# Altium schematic sheet SDRAM_DDR3_4x16.SchDoc: Sayma AMC
size 420 x 297 mm; $$Internal___BlkDate: 0:12:25_2-9-18; $$Internal_NAME_PLACEHOLDER: a3sheet; $$Internal_Resolution: 00001mm; $$NotCommonProperty_@NAME: SDRAM_DDR3_4x16; $$NotCommonProperty_@PRINTORDER: 2; $$NotCommonProperty_@SHEET: 1; $$NotCommonProperty_@SHEETTOTAL: 30; CmpIndex: 122; Drawing Author: G.Kasprowicz; Drawing Number: Sayma AMC; Drawing Project: AMC FMC Carrier Board; Drawing Revision: 2.0; SymIndex: 2141; CheckedBy: P.Kulik,T.Przywozki,W.Ruclo; Author: G.Kasprowicz; CompanyName: WUT ISE; DrawnBy: G.Kasprowicz; Organization: WUT ISE; Address1: PW ISE; Address2: Nowowiejska 15/19 00-665 Warsaw; Address3: gkasprow@gmail.com; DocumentNumber: 24; Revision: 2; SheetNumber: 24; SheetTotal: 32; ModifiedBy: -; CheckedDate: -; Title2: DDR3 - 64bit; DivGrp: WUT ISE; Designer: G.Kasprowicz; ModifiedDate: -; ProjectName: Sensor Box
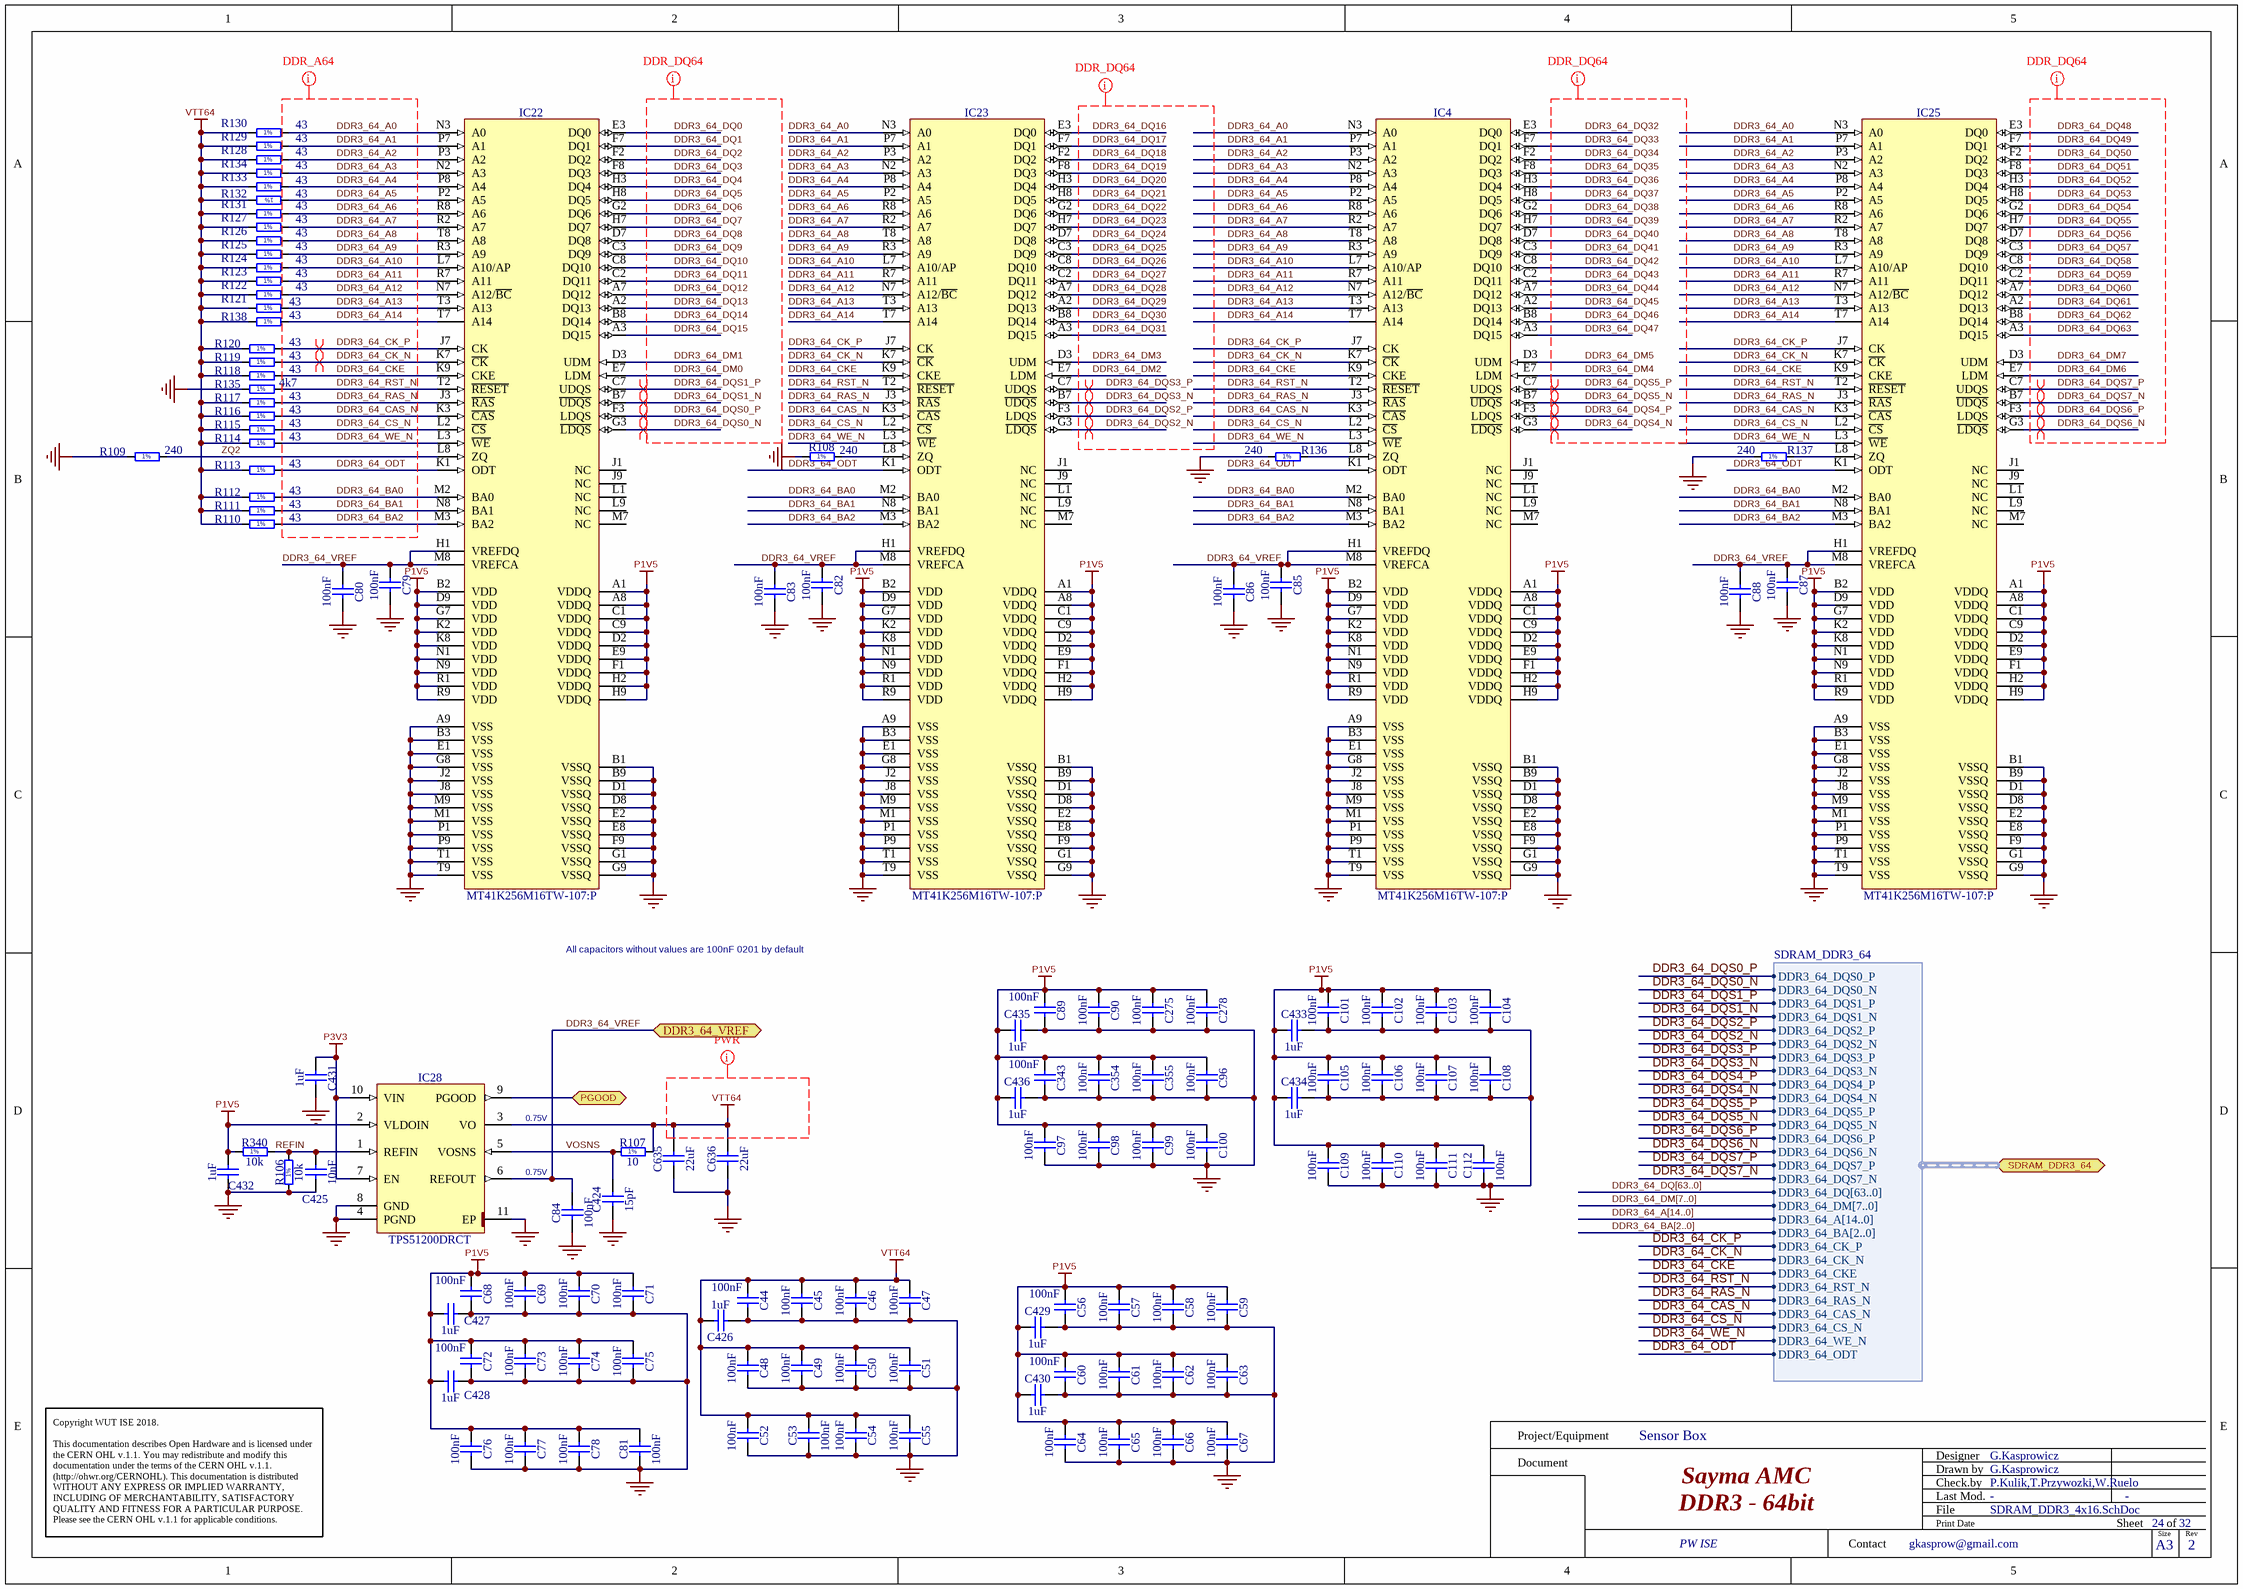
[diagram p0: SDRAM_DDR3_4x16.SchDoc]

## Parts
C44  100nF  [CAPC0603X33N]
C45  100nF  [CAPC0603X33N]
C46  100nF  [CAPC0603X33N]
C47  100nF  [CAPC0603X33N]
C48  100nF  [CAPC0603X33N]
C49  100nF  [CAPC0603X33N]
C50  100nF  [CAPC0603X33N]
C51  100nF  [CAPC0603X33N]
C52  100nF  [CAPC0603X33N]
C53  100nF  [CAPC0603X33N]
C54  100nF  [CAPC0603X33N]
C55  100nF  [CAPC0603X33N]
C56  100nF  [CAPC0603X33N]
C57  100nF  [CAPC0603X33N]
C58  100nF  [CAPC0603X33N]
C59  100nF  [CAPC0603X33N]
C60  100nF  [CAPC0603X33N]
C61  100nF  [CAPC0603X33N]
C62  100nF  [CAPC0603X33N]
C63  100nF  [CAPC0603X33N]
C64  100nF  [CAPC0603X33N]
C65  100nF  [CAPC0603X33N]
C66  100nF  [CAPC0603X33N]
C67  100nF  [CAPC0603X33N]
C68  100nF  [CAPC0603X33N]
C69  100nF  [CAPC0603X33N]
C70  100nF  [CAPC0603X33N]
C71  100nF  [CAPC0603X33N]
C72  100nF  [CAPC0603X33N]
C73  100nF  [CAPC0603X33N]
C74  100nF  [CAPC0603X33N]
C75  100nF  [CAPC0603X33N]
C76  100nF  [CAPC0603X33N]
C77  100nF  [CAPC0603X33N]
C78  100nF  [CAPC0603X33N]
C79  100nF  [CAPC0603X33N]
C80  100nF  [CAPC0603X33N]
C81  100nF  [CAPC0603X33N]
C82  100nF  [CAPC0603X33N]
C83  100nF  [CAPC0603X33N]
C84  100nF  [CAPC0603X33N]
C85  100nF  [CAPC0603X33N]
C86  100nF  [CAPC0603X33N]
C87  100nF  [CAPC0603X33N]
C88  100nF  [CAPC0603X33N]
C89  100nF  [CAPC0603X33N]
C90  100nF  [CAPC0603X33N]
C96  100nF  [CAPC0603X33N]
C97  100nF  [CAPC0603X33N]
C98  100nF  [CAPC0603X33N]
C99  100nF  [CAPC0603X33N]
C100  100nF  [CAPC0603X33N]
C101  100nF  [CAPC0603X33N]
C102  100nF  [CAPC0603X33N]
C103  100nF  [CAPC0603X33N]
C104  100nF  [CAPC0603X33N]
C105  100nF  [CAPC0603X33N]
C106  100nF  [CAPC0603X33N]
C107  100nF  [CAPC0603X33N]
C108  100nF  [CAPC0603X33N]
C109  100nF  [CAPC0603X33N]
C110  100nF  [CAPC0603X33N]
C111  100nF  [CAPC0603X33N]
C112  100nF  [CAPC0603X33N]
C275  100nF  [CAPC0603X33N]
C278  100nF  [CAPC0603X33N]
C343  100nF  [CAPC0603X33N]
C354  100nF  [CAPC0603X33N]
C355  100nF  [CAPC0603X33N]
C424  15pF  [CAPC1005X55N]
C425  10nF  [CAPC1005X55N]
C426  1uF  [CAPC1005X55N]
C427  1uF  [CAPC1005X55N]
C428  1uF  [CAPC1005X55N]
C429  1uF  [CAPC1005X55N]
C430  1uF  [CAPC1005X55N]
C431  1uF  [CAPC1005X55N]
C432  1uF  [CAPC1005X55N]
C433  1uF  [CAPC1005X55N]
C434  1uF  [CAPC1005X55N]
C435  1uF  [CAPC1005X55N]
C436  1uF  [CAPC1005X55N]
C635  22uF  [CAPC2012X135N]
C636  22uF  [CAPC2012X135N]
IC4  MT41K256M16TW-107:P  [BGA96C80P9X16_800X1400X120]
IC22  MT41K256M16TW-107:P  [BGA96C80P9X16_800X1400X120]
IC23  MT41K256M16TW-107:P  [BGA96C80P9X16_800X1400X120]
IC25  MT41K256M16TW-107:P  [BGA96C80P9X16_800X1400X120]
IC28  TPS51200DRCT  [TEXAS_DRC (S-PVSON-N10)]
R106  10k  [RESC1005X40N]
R107  10  [RESC1005X40N]
R108  240  [RESC1005X40N]
R109  240  [RESC1005X40N]
R110  43  [RESC1005X40N]
R111  43  [RESC1005X40N]
R112  43  [RESC1005X40N]
R113  43  [RESC1005X40N]
R114  43  [RESC1005X40N]
R115  43  [RESC1005X40N]
R116  43  [RESC1005X40N]
R117  43  [RESC1005X40N]
R118  43  [RESC1005X40N]
R119  43  [RESC1005X40N]
R120  43  [RESC1005X40N]
R121  43  [RESC1005X40N]
R122  43  [RESC1005X40N]
R123  43  [RESC1005X40N]
R124  43  [RESC1005X40N]
R125  43  [RESC1005X40N]
R126  43  [RESC1005X40N]
R127  43  [RESC1005X40N]
R128  43  [RESC1005X40N]
R129  43  [RESC1005X40N]
R130  43  [RESC1005X40N]
R131  43  [RESC1005X40N]
R132  43  [RESC1005X40N]
R133  43  [RESC1005X40N]
R134  43  [RESC1005X40N]
R135  4k7  [RESC1005X40N]
R136  240  [RESC1005X40N]
R137  240  [RESC1005X40N]
R138  43  [RESC1005X40N]
R340  10k  [RESC1005X40N]

## Ports
DDR3_64_VREF (bidir), PGOOD (bidir), SDRAM_DDR3_64 (bidir, harness SDRAM_DDR3_64)

## Harnesses
SDRAM_DDR3_64: DDR3_64_DQS0_P, DDR3_64_DQS0_N, DDR3_64_DQS1_P, DDR3_64_DQS1_N, DDR3_64_DQS2_P, DDR3_64_DQS2_N, DDR3_64_DQS3_P, DDR3_64_DQS3_N, DDR3_64_DQS4_P, DDR3_64_DQS4_N, DDR3_64_DQS5_P, DDR3_64_DQS5_N, DDR3_64_DQS6_P, DDR3_64_DQS6_N, DDR3_64_DQS7_P, DDR3_64_DQS7_N, DDR3_64_DQ[63..0], DDR3_64_DM[7..0], DDR3_64_A[14..0], DDR3_64_BA[2..0], DDR3_64_CK_P, DDR3_64_CK_N, DDR3_64_CKE, DDR3_64_RST_N, DDR3_64_RAS_N, DDR3_64_CAS_N, DDR3_64_CS_N, DDR3_64_WE_N, DDR3_64_ODT

## Nets
GND: C44.2 C45.2 C46.2 C47.2 C48.2 C49.2 C50.2 C51.2 C52.2 C53.2 C54.2 C55.2 C56.2 C57.2 C58.2 C59.2 C60.2 C61.2 C62.2 C63.2 C64.2 C65.2 C66.2 C67.2 C68.2 C69.2 C70.2 C71.2 C72.2 C73.2 C74.2 C75.2 C76.2 C77.2 C78.2 C79.2 C80.2 C81.1 C82.2 C83.2 C84.1 C85.2 C86.2 C87.2 C88.2 C89.2 C90.2 C96.2 C97.2 C98.2 C99.2 C100.2 C101.2 C102.2 C103.2 C104.2 C105.2 C106.2 C107.2 C108.2 C109.2 C110.2 C111.2 C112.1 C275.2 C278.2 C343.2 C354.2 C355.2 C424.1 C425.1 C426.2 C427.2 C428.2 C429.2 C430.2 C431.2 C432.2 C433.2 C434.2 C435.2 C436.2 C635.1 C636.1 IC4.A9(VSS) IC4.B1(VSSQ) IC4.B3(VSS) IC4.B9(VSSQ) IC4.D1(VSSQ) IC4.D8(VSSQ) IC4.E1(VSS) IC4.E2(VSSQ) IC4.E8(VSSQ) IC4.F9(VSSQ) IC4.G1(VSSQ) IC4.G8(VSS) IC4.G9(VSSQ) IC4.J2(VSS) IC4.J8(VSS) IC4.M1(VSS) IC4.M9(VSS) IC4.P1(VSS) IC4.P9(VSS) IC4.T1(VSS) IC4.T9(VSS) IC22.A9(VSS) IC22.B1(VSSQ) IC22.B3(VSS) IC22.B9(VSSQ) IC22.D1(VSSQ) IC22.D8(VSSQ) IC22.E1(VSS) IC22.E2(VSSQ) IC22.E8(VSSQ) IC22.F9(VSSQ) IC22.G1(VSSQ) IC22.G8(VSS) IC22.G9(VSSQ) IC22.J2(VSS) IC22.J8(VSS) IC22.M1(VSS) IC22.M9(VSS) IC22.P1(VSS) IC22.P9(VSS) IC22.T1(VSS) IC22.T9(VSS) IC23.A9(VSS) IC23.B1(VSSQ) IC23.B3(VSS) IC23.B9(VSSQ) IC23.D1(VSSQ) IC23.D8(VSSQ) IC23.E1(VSS) IC23.E2(VSSQ) IC23.E8(VSSQ) IC23.F9(VSSQ) IC23.G1(VSSQ) IC23.G8(VSS) IC23.G9(VSSQ) IC23.J2(VSS) IC23.J8(VSS) IC23.M1(VSS) IC23.M9(VSS) IC23.P1(VSS) IC23.P9(VSS) IC23.T1(VSS) IC23.T9(VSS) IC25.A9(VSS) IC25.B1(VSSQ) IC25.B3(VSS) IC25.B9(VSSQ) IC25.D1(VSSQ) IC25.D8(VSSQ) IC25.E1(VSS) IC25.E2(VSSQ) IC25.E8(VSSQ) IC25.F9(VSSQ) IC25.G1(VSSQ) IC25.G8(VSS) IC25.G9(VSSQ) IC25.J2(VSS) IC25.J8(VSS) IC25.M1(VSS) IC25.M9(VSS) IC25.P1(VSS) IC25.P9(VSS) IC25.T1(VSS) IC25.T9(VSS) IC28.4(PGND) IC28.8(GND) IC28.11(EP) R106.1 R108.1 R109.1 R135.1 R136.1 R137.1
P1V5: C56.1 C57.1 C58.1 C59.1 C60.1 C61.1 C62.1 C63.1 C64.1 C65.1 C66.1 C67.1 C68.1 C69.1 C70.1 C71.1 C72.1 C73.1 C74.1 C75.1 C76.1 C77.1 C78.1 C81.2 C89.1 C90.1 C96.1 C97.1 C98.1 C99.1 C100.1 C101.1 C102.1 C103.1 C104.1 C105.1 C106.1 C107.1 C108.1 C109.1 C110.1 C111.1 C112.2 C275.1 C278.1 C343.1 C354.1 C355.1 C427.1 C428.1 C429.1 C430.1 C432.1 C433.1 C434.1 C435.1 C436.1 IC4.A1(VDDQ) IC4.A8(VDDQ) IC4.B2(VDD) IC4.C1(VDDQ) IC4.C9(VDDQ) IC4.D2(VDDQ) IC4.D9(VDD) IC4.E9(VDDQ) IC4.F1(VDDQ) IC4.G7(VDD) IC4.H2(VDDQ) IC4.H9(VDDQ) IC4.K2(VDD) IC4.K8(VDD) IC4.N1(VDD) IC4.N9(VDD) IC4.R1(VDD) IC4.R9(VDD) IC22.A1(VDDQ) IC22.A8(VDDQ) IC22.B2(VDD) IC22.C1(VDDQ) IC22.C9(VDDQ) IC22.D2(VDDQ) IC22.D9(VDD) IC22.E9(VDDQ) IC22.F1(VDDQ) IC22.G7(VDD) IC22.H2(VDDQ) IC22.H9(VDDQ) IC22.K2(VDD) IC22.K8(VDD) IC22.N1(VDD) IC22.N9(VDD) IC22.R1(VDD) IC22.R9(VDD) IC23.A1(VDDQ) IC23.A8(VDDQ) IC23.B2(VDD) IC23.C1(VDDQ) IC23.C9(VDDQ) IC23.D2(VDDQ) IC23.D9(VDD) IC23.E9(VDDQ) IC23.F1(VDDQ) IC23.G7(VDD) IC23.H2(VDDQ) IC23.H9(VDDQ) IC23.K2(VDD) IC23.K8(VDD) IC23.N1(VDD) IC23.N9(VDD) IC23.R1(VDD) IC23.R9(VDD) IC25.A1(VDDQ) IC25.A8(VDDQ) IC25.B2(VDD) IC25.C1(VDDQ) IC25.C9(VDDQ) IC25.D2(VDDQ) IC25.D9(VDD) IC25.E9(VDDQ) IC25.F1(VDDQ) IC25.G7(VDD) IC25.H2(VDDQ) IC25.H9(VDDQ) IC25.K2(VDD) IC25.K8(VDD) IC25.N1(VDD) IC25.N9(VDD) IC25.R1(VDD) IC25.R9(VDD) IC28.2(VLDOIN) R340.1
P3V3: C431.1 IC28.7(EN) IC28.10(VIN)
VTT64: C44.1 C45.1 C46.1 C47.1 C48.1 C49.1 C50.1 C51.1 C52.1 C53.1 C54.1 C55.1 C426.1 C635.2 C636.2 IC28.3(VO) R107.2 R110.1 R111.1 R112.1 R113.1 R114.1 R115.1 R116.1 R117.1 R118.1 R119.1 R120.1 R121.1 R122.1 R123.1 R124.1 R125.1 R126.1 R127.1 R128.1 R129.1 R130.1 R131.1 R132.1 R133.1 R134.1 R138.1
DDR3_64_A0: IC4.N3(A0) IC22.N3(A0) IC23.N3(A0) IC25.N3(A0) R130.2
DDR3_64_A1: IC4.P7(A1) IC22.P7(A1) IC23.P7(A1) IC25.P7(A1) R129.2
DDR3_64_A2: IC4.P3(A2) IC22.P3(A2) IC23.P3(A2) IC25.P3(A2) R128.2
DDR3_64_A3: IC4.N2(A3) IC22.N2(A3) IC23.N2(A3) IC25.N2(A3) R134.2
DDR3_64_A4: IC4.P8(A4) IC22.P8(A4) IC23.P8(A4) IC25.P8(A4) R133.2
DDR3_64_A5: IC4.P2(A5) IC22.P2(A5) IC23.P2(A5) IC25.P2(A5) R132.2
DDR3_64_A6: IC4.R8(A6) IC22.R8(A6) IC23.R8(A6) IC25.R8(A6) R131.2
DDR3_64_A7: IC4.R2(A7) IC22.R2(A7) IC23.R2(A7) IC25.R2(A7) R127.2
DDR3_64_A8: IC4.T8(A8) IC22.T8(A8) IC23.T8(A8) IC25.T8(A8) R126.2
DDR3_64_A9: IC4.R3(A9) IC22.R3(A9) IC23.R3(A9) IC25.R3(A9) R125.2
DDR3_64_A10: IC4.L7(A10/AP) IC22.L7(A10/AP) IC23.L7(A10/AP) IC25.L7(A10/AP) R124.2
DDR3_64_A11: IC4.R7(A11) IC22.R7(A11) IC23.R7(A11) IC25.R7(A11) R123.2
DDR3_64_A12: IC4.N7(A12/~{BC}) IC22.N7(A12/~{BC}) IC23.N7(A12/~{BC}) IC25.N7(A12/~{BC}) R122.2
DDR3_64_A13: IC4.T3(A13) IC22.T3(A13) IC23.T3(A13) IC25.T3(A13) R121.2
DDR3_64_A14: IC4.T7(A14) IC22.T7(A14) IC23.T7(A14) IC25.T7(A14) R138.2
DDR3_64_BA0: IC4.M2(BA0) IC22.M2(BA0) IC23.M2(BA0) IC25.M2(BA0) R112.2
DDR3_64_BA1: IC4.N8(BA1) IC22.N8(BA1) IC23.N8(BA1) IC25.N8(BA1) R111.2
DDR3_64_BA2: IC4.M3(BA2) IC22.M3(BA2) IC23.M3(BA2) IC25.M3(BA2) R110.2
DDR3_64_CAS_N: IC4.K3(~{CAS}) IC22.K3(~{CAS}) IC23.K3(~{CAS}) IC25.K3(~{CAS}) R116.2 ; port SDRAM_DDR3_64.DDR3_64_CAS_N
DDR3_64_CK_N: IC4.K7(~{CK}) IC22.K7(~{CK}) IC23.K7(~{CK}) IC25.K7(~{CK}) R119.2 ; port SDRAM_DDR3_64.DDR3_64_CK_N
DDR3_64_CK_P: IC4.J7(CK) IC22.J7(CK) IC23.J7(CK) IC25.J7(CK) R120.2 ; port SDRAM_DDR3_64.DDR3_64_CK_P
DDR3_64_CKE: IC4.K9(CKE) IC22.K9(CKE) IC23.K9(CKE) IC25.K9(CKE) R118.2 ; port SDRAM_DDR3_64.DDR3_64_CKE
DDR3_64_CS_N: IC4.L2(~{CS}) IC22.L2(~{CS}) IC23.L2(~{CS}) IC25.L2(~{CS}) R115.2 ; port SDRAM_DDR3_64.DDR3_64_CS_N
DDR3_64_DM0: IC22.E7(LDM)
DDR3_64_DM1: IC22.D3(UDM)
DDR3_64_DM2: IC23.E7(LDM)
DDR3_64_DM3: IC23.D3(UDM)
DDR3_64_DM4: IC4.E7(LDM)
DDR3_64_DM5: IC4.D3(UDM)
DDR3_64_DM6: IC25.E7(LDM)
DDR3_64_DM7: IC25.D3(UDM)
DDR3_64_DQ0: IC22.E3(DQ0)
DDR3_64_DQ1: IC22.F7(DQ1)
DDR3_64_DQ2: IC22.F2(DQ2)
DDR3_64_DQ3: IC22.F8(DQ3)
DDR3_64_DQ4: IC22.H3(DQ4)
DDR3_64_DQ5: IC22.H8(DQ5)
DDR3_64_DQ6: IC22.G2(DQ6)
DDR3_64_DQ7: IC22.H7(DQ7)
DDR3_64_DQ8: IC22.D7(DQ8)
DDR3_64_DQ9: IC22.C3(DQ9)
DDR3_64_DQ10: IC22.C8(DQ10)
DDR3_64_DQ11: IC22.C2(DQ11)
DDR3_64_DQ12: IC22.A7(DQ12)
DDR3_64_DQ13: IC22.A2(DQ13)
DDR3_64_DQ14: IC22.B8(DQ14)
DDR3_64_DQ15: IC22.A3(DQ15)
DDR3_64_DQ16: IC23.E3(DQ0)
DDR3_64_DQ17: IC23.F7(DQ1)
DDR3_64_DQ18: IC23.F2(DQ2)
DDR3_64_DQ19: IC23.F8(DQ3)
DDR3_64_DQ20: IC23.H3(DQ4)
DDR3_64_DQ21: IC23.H8(DQ5)
DDR3_64_DQ22: IC23.G2(DQ6)
DDR3_64_DQ23: IC23.H7(DQ7)
DDR3_64_DQ24: IC23.D7(DQ8)
DDR3_64_DQ25: IC23.C3(DQ9)
DDR3_64_DQ26: IC23.C8(DQ10)
DDR3_64_DQ27: IC23.C2(DQ11)
DDR3_64_DQ28: IC23.A7(DQ12)
DDR3_64_DQ29: IC23.A2(DQ13)
DDR3_64_DQ30: IC23.B8(DQ14)
DDR3_64_DQ31: IC23.A3(DQ15)
DDR3_64_DQ32: IC4.E3(DQ0)
DDR3_64_DQ33: IC4.F7(DQ1)
DDR3_64_DQ34: IC4.F2(DQ2)
DDR3_64_DQ35: IC4.F8(DQ3)
DDR3_64_DQ36: IC4.H3(DQ4)
DDR3_64_DQ37: IC4.H8(DQ5)
DDR3_64_DQ38: IC4.G2(DQ6)
DDR3_64_DQ39: IC4.H7(DQ7)
DDR3_64_DQ40: IC4.D7(DQ8)
DDR3_64_DQ41: IC4.C3(DQ9)
DDR3_64_DQ42: IC4.C8(DQ10)
DDR3_64_DQ43: IC4.C2(DQ11)
DDR3_64_DQ44: IC4.A7(DQ12)
DDR3_64_DQ45: IC4.A2(DQ13)
DDR3_64_DQ46: IC4.B8(DQ14)
DDR3_64_DQ47: IC4.A3(DQ15)
DDR3_64_DQ48: IC25.E3(DQ0)
DDR3_64_DQ49: IC25.F7(DQ1)
DDR3_64_DQ50: IC25.F2(DQ2)
DDR3_64_DQ51: IC25.F8(DQ3)
DDR3_64_DQ52: IC25.H3(DQ4)
DDR3_64_DQ53: IC25.H8(DQ5)
DDR3_64_DQ54: IC25.G2(DQ6)
DDR3_64_DQ55: IC25.H7(DQ7)
DDR3_64_DQ56: IC25.D7(DQ8)
DDR3_64_DQ57: IC25.C3(DQ9)
DDR3_64_DQ58: IC25.C8(DQ10)
DDR3_64_DQ59: IC25.C2(DQ11)
DDR3_64_DQ60: IC25.A7(DQ12)
DDR3_64_DQ61: IC25.A2(DQ13)
DDR3_64_DQ62: IC25.B8(DQ14)
DDR3_64_DQ63: IC25.A3(DQ15)
DDR3_64_DQS0_N: IC22.G3(~{LDQS}) ; port SDRAM_DDR3_64.DDR3_64_DQS0_N
DDR3_64_DQS0_P: IC22.F3(LDQS) ; port SDRAM_DDR3_64.DDR3_64_DQS0_P
DDR3_64_DQS1_N: IC22.B7(~{UDQS}) ; port SDRAM_DDR3_64.DDR3_64_DQS1_N
DDR3_64_DQS1_P: IC22.C7(UDQS) ; port SDRAM_DDR3_64.DDR3_64_DQS1_P
DDR3_64_DQS2_N: IC23.G3(~{LDQS}) ; port SDRAM_DDR3_64.DDR3_64_DQS2_N
DDR3_64_DQS2_P: IC23.F3(LDQS) ; port SDRAM_DDR3_64.DDR3_64_DQS2_P
DDR3_64_DQS3_N: IC23.B7(~{UDQS}) ; port SDRAM_DDR3_64.DDR3_64_DQS3_N
DDR3_64_DQS3_P: IC23.C7(UDQS) ; port SDRAM_DDR3_64.DDR3_64_DQS3_P
DDR3_64_DQS4_N: IC4.G3(~{LDQS}) ; port SDRAM_DDR3_64.DDR3_64_DQS4_N
DDR3_64_DQS4_P: IC4.F3(LDQS) ; port SDRAM_DDR3_64.DDR3_64_DQS4_P
DDR3_64_DQS5_N: IC4.B7(~{UDQS}) ; port SDRAM_DDR3_64.DDR3_64_DQS5_N
DDR3_64_DQS5_P: IC4.C7(UDQS) ; port SDRAM_DDR3_64.DDR3_64_DQS5_P
DDR3_64_DQS6_N: IC25.G3(~{LDQS}) ; port SDRAM_DDR3_64.DDR3_64_DQS6_N
DDR3_64_DQS6_P: IC25.F3(LDQS) ; port SDRAM_DDR3_64.DDR3_64_DQS6_P
DDR3_64_DQS7_N: IC25.B7(~{UDQS}) ; port SDRAM_DDR3_64.DDR3_64_DQS7_N
DDR3_64_DQS7_P: IC25.C7(UDQS) ; port SDRAM_DDR3_64.DDR3_64_DQS7_P
DDR3_64_ODT: IC4.K1(ODT) IC22.K1(ODT) IC23.K1(ODT) IC25.K1(ODT) R113.2 ; port SDRAM_DDR3_64.DDR3_64_ODT
DDR3_64_RAS_N: IC4.J3(~{RAS}) IC22.J3(~{RAS}) IC23.J3(~{RAS}) IC25.J3(~{RAS}) R117.2 ; port SDRAM_DDR3_64.DDR3_64_RAS_N
DDR3_64_RST_N: IC4.T2(~{RESET}) IC22.T2(~{RESET}) IC23.T2(~{RESET}) IC25.T2(~{RESET}) R135.2 ; port SDRAM_DDR3_64.DDR3_64_RST_N
DDR3_64_VREF: C79.1 C80.1 C82.1 C83.1 C84.2 C85.1 C86.1 C87.1 C88.1 IC4.H1(VREFDQ) IC4.M8(VREFCA) IC22.H1(VREFDQ) IC22.M8(VREFCA) IC23.H1(VREFDQ) IC23.M8(VREFCA) IC25.H1(VREFDQ) IC25.M8(VREFCA) IC28.6(REFOUT) ; port DDR3_64_VREF
DDR3_64_WE_N: IC4.L3(~{WE}) IC22.L3(~{WE}) IC23.L3(~{WE}) IC25.L3(~{WE}) R114.2 ; port SDRAM_DDR3_64.DDR3_64_WE_N
PGOOD: IC28.9(PGOOD) ; port PGOOD
REFIN: C425.2 IC28.1(REFIN) R106.2 R340.2
VOSNS: C424.2 IC28.5(VOSNS) R107.1
ZQ2: IC22.L8(ZQ) R109.2
NetIC4_L8: IC4.L8(ZQ) R136.2
NetIC23_L8: IC23.L8(ZQ) R108.2
NetIC25_L8: IC25.L8(ZQ) R137.2

Not connected (* = marked no-connect by the designer): IC4 J1(NC) J9(NC) L1(NC) L9(NC) M7(NC); IC22 J1(NC) J9(NC) L1(NC) L9(NC) M7(NC); IC23 J1(NC) J9(NC) L1(NC) L9(NC) M7(NC); IC25 J1(NC) J9(NC) L1(NC) L9(NC) M7(NC)

## Buses and harness runs
bus DDR3_64_A[14..0]
bus DDR3_64_BA[2..0]
bus DDR3_64_DM[7..0]
bus DDR3_64_DQ[63..0]

## Layout directives
differential pair: DDR3_64_CK_N, DDR3_64_CK_P, DDR3_64_DQS0_N, DDR3_64_DQS0_P, DDR3_64_DQS1_N, DDR3_64_DQS1_P, DDR3_64_DQS2_N, DDR3_64_DQS2_P, DDR3_64_DQS3_N, DDR3_64_DQS3_P, DDR3_64_DQS4_N, DDR3_64_DQS4_P, DDR3_64_DQS5_N, DDR3_64_DQS5_P, DDR3_64_DQS6_N, DDR3_64_DQS6_P, DDR3_64_DQS7_N, DDR3_64_DQS7_P
net class DDR_DQ64: DDR3_64_DM0, DDR3_64_DM1, DDR3_64_DM2, DDR3_64_DM3, DDR3_64_DM4, DDR3_64_DM5, DDR3_64_DM6, DDR3_64_DM7, DDR3_64_DQ0, DDR3_64_DQ1, DDR3_64_DQ2, DDR3_64_DQ3, DDR3_64_DQ4, DDR3_64_DQ5, DDR3_64_DQ6, DDR3_64_DQ7, DDR3_64_DQ8, DDR3_64_DQ9, DDR3_64_DQ10, DDR3_64_DQ11, DDR3_64_DQ12, DDR3_64_DQ13, DDR3_64_DQ14, DDR3_64_DQ15, DDR3_64_DQ16, DDR3_64_DQ17, DDR3_64_DQ18, DDR3_64_DQ19, DDR3_64_DQ20, DDR3_64_DQ21, DDR3_64_DQ22, DDR3_64_DQ23, DDR3_64_DQ24, DDR3_64_DQ25, DDR3_64_DQ26, DDR3_64_DQ27, DDR3_64_DQ28, DDR3_64_DQ29, DDR3_64_DQ30, DDR3_64_DQ31, DDR3_64_DQ32, DDR3_64_DQ33, DDR3_64_DQ34, DDR3_64_DQ35, DDR3_64_DQ36, DDR3_64_DQ37, DDR3_64_DQ38, DDR3_64_DQ39, DDR3_64_DQ40, DDR3_64_DQ41, DDR3_64_DQ42, DDR3_64_DQ43, DDR3_64_DQ44, DDR3_64_DQ45, DDR3_64_DQ46, DDR3_64_DQ47, DDR3_64_DQ48, DDR3_64_DQ49, DDR3_64_DQ50, DDR3_64_DQ51, DDR3_64_DQ52, DDR3_64_DQ53, DDR3_64_DQ54, DDR3_64_DQ55, DDR3_64_DQ56, DDR3_64_DQ57, DDR3_64_DQ58, DDR3_64_DQ59, DDR3_64_DQ60, DDR3_64_DQ61, DDR3_64_DQ62, DDR3_64_DQ63, DDR3_64_DQS0_N, DDR3_64_DQS0_P, DDR3_64_DQS1_N, DDR3_64_DQS1_P, DDR3_64_DQS2_N, DDR3_64_DQS2_P, DDR3_64_DQS3_N, DDR3_64_DQS3_P, DDR3_64_DQS4_N, DDR3_64_DQS4_P, DDR3_64_DQS5_N, DDR3_64_DQS5_P, DDR3_64_DQS6_N, DDR3_64_DQS6_P, DDR3_64_DQS7_N, DDR3_64_DQS7_P
net class DDR_A64: DDR3_64_A0, DDR3_64_A1, DDR3_64_A2, DDR3_64_A3, DDR3_64_A4, DDR3_64_A5, DDR3_64_A6, DDR3_64_A7, DDR3_64_A8, DDR3_64_A9, DDR3_64_A10, DDR3_64_A11, DDR3_64_A12, DDR3_64_A13, DDR3_64_A14, DDR3_64_BA0, DDR3_64_BA1, DDR3_64_BA2, DDR3_64_CAS_N, DDR3_64_CK_N, DDR3_64_CK_P, DDR3_64_CKE, DDR3_64_CS_N, DDR3_64_ODT, DDR3_64_RAS_N, DDR3_64_RST_N, DDR3_64_WE_N
net class PWR: VTT64

## Notes on the sheet
- All capacitors without values are 100nF 0201 by default
- (near IC28) 0.75V
- 0.75V
- Project/Equipment
- Document
- Designer
- Drawn by
- Check.by
- Copyright WUT ISE 2018.
  This documentation describes Open Hardware and is licensed under the CERN OHL v.1.1. You may redistribute and modify this documentation under the terms of the CERN OHL v.1.1. (http://ohwr.org/CERNOHL). This documentation is distributed WITHOUT ANY EXPRESS OR IMPLIED WARRANTY, INCLUDING OF MERCHANTABILITY, SATISFACTORY QUALITY AND FITNESS FOR A PARTICULAR PURPOSE. Please see the CERN OHL v.1.1 for applicable conditions.
- Contact
- File
- Last Mod.
- Print Date
- Sheet
- Size
- A3
- of
- Rev
- (in symbol R0402_4K7_1%_0.0625W_100PPM) 1%
- (in symbol R0402_10K_1%_0.0625W_100PPM) 1%
- (in symbol R0402_10R_1%_0.0625W_200PPM) 1%
- (in symbol R0402_43R_1%_0.0625W_100PPM) 1%
- (in symbol R0402_240R_1%_0.0625W_100PPM) 1%

## Library data of the parts
C44-C90 C96-C112 C275 C278 C343 C354 C355 = CC0201_100NF_6.3V_10%_X5R: Non-polarised capacitor; Manufacturer: GENERIC; Part Description: SMD Multilayer Chip Ceramic Capacitor; Manufacturer1 Part Number: 02016D104KAT2A; Tolerance: ±10%; Voltage: 6.3V; TC: X5R; Manufacturer Part Number: CC0201_100NF_6.3V_10%_X5R; Part Number: CC0201_100NF_6.3V_10%_X5R; Value: 100nF; Component Kind: Standard; Component Type: Standard; Pin Count: 2; Status: Not Recommended; Case: 0201; Mounted: Yes; Socket: No; SMD: Yes; Sense: No; Manufacturer1 Example: AVX; Manufacturer1 ComponentHeight: 0.33mm; HelpURL: \\cern.ch\dfs\Applications\Altium\Datasheets\CC0201_X5R_AVX.pdf; Author: CERN DEM JLC; CreateDate: 03.12.2007; LatestRevisionDate: 03.12.2007
C424 = CC0402_15PF_50V_5%_C0G: Non-polarised capacitor; Manufacturer: GENERIC; Part Description: SMD Multilayer Chip Ceramic Capacitor; Manufacturer1 Part Number: C0402C150J5GACTU; Tolerance: ±5%; Voltage: 50V; TC: C0G/NP0; Manufacturer Part Number: CC0402_15PF_50V_5%_C0G; Part Number: CC0402_15PF_50V_5%_C0G; Value: 15pF; Component Kind: Standard; Component Type: Standard; Pin Count: 2; Status: Preferred; Case: 0402; Mounted: Yes; Socket: No; SMD: Yes; Sense: No; Manufacturer1 Example: KEMET; Manufacturer1 ComponentHeight: 0.55mm; HelpURL: \\cern.ch\dfs\Applications\Altium\Datasheets\CC0805_C0G_KEMET_(Commercial Grade).pdf; Author: CERN DEM JLC; CreateDate: 03.12.2007; LatestRevisionDate: 22.04.2015
C425 = CC0402_10NF_25V_10%_X7R: Non-polarised capacitor; Manufacturer: GENERIC; Part Description: SMD Multilayer Chip Ceramic Capacitor; Manufacturer1 Part Number: C1005X7R1E103KT; Tolerance: ±10%; Voltage: 25V; TC: X7R; Manufacturer Part Number: CC0402_10NF_25V_10%_X7R; Part Number: CC0402_10NF_25V_10%_X7R; Value: 10nF; Component Kind: Standard; Component Type: Standard; Pin Count: 2; Status: Preferred; Case: 0402; Mounted: Yes; Socket: No; SMD: Yes; Sense: No; Manufacturer1 Example: TDK; Manufacturer1 ComponentHeight: 0.55mm; HelpURL: \\cern.ch\dfs\Applications\Altium\Datasheets\CC0402_X7R_TDK_C.pdf; Author: CERN DEM JLC; CreateDate: 25.10.2012; LatestRevisionDate: 25.10.2012
C426-C436 = CC0402_1UF_16V_10%_X5R: Non-polarised capacitor; Manufacturer: GENERIC; Part Description: SMD Multilayer Chip Ceramic Capacitor; Manufacturer1 Part Number: C1005X5R1C105KT; Tolerance: ±10%; Voltage: 16V; TC: X5R; Manufacturer Part Number: CC0402_1UF_16V_10%_X5R; Part Number: CC0402_1UF_16V_10%_X5R; Value: 1uF; Component Kind: Standard; Component Type: Standard; Pin Count: 2; Status: Preferred; Case: 0402; Mounted: Yes; Socket: No; SMD: Yes; Sense: No; Manufacturer1 Example: TDK; Manufacturer1 ComponentHeight: 0.55mm; HelpURL: \\cern.ch\dfs\Applications\Altium\Datasheets\CC0402_X5R_TDK_C.pdf; Author: CERN DEM JLC; CreateDate: 25.10.2012; LatestRevisionDate: 25.10.2012
C635 C636 = CC0805_22UF_10V_+80%-20%_Y5V: Non-polarised capacitor; Manufacturer: GENERIC; Part Description: SMD Multilayer Chip Ceramic Capacitor; Manufacturer1 Part Number: 2222 241 19881; Voltage: 10V; TC: Y5V; Manufacturer Part Number: CC0805_22UF_10V_+80%-20%_Y5V; Part Number: CC0805_22UF_10V_+80%-20%_Y5V; Tolerance: +80% -20%; Value: 22uF; Component Kind: Standard; Component Type: Standard; Pin Count: 2; Status: Preferred; Case: 0805; Mounted: Yes; Socket: No; SMD: Yes; Sense: No; Manufacturer1 Example: PHYCOMP; Manufacturer1 ComponentHeight: 1.45mm; HelpURL: \\cern.ch\dfs\Applications\Altium\Datasheets\CC0805_Y5V_PHYCOMP.pdf; Author: CERN DEM JLC; CreateDate: 03.12.2007; LatestRevisionDate: 03.12.2007
IC4 IC22 IC23 IC25 = MT41K256M16TW-107:P: 32 Meg x 16 x 8 Banks DDR3L SDRAM; Manufacturer: MICRON TECHNOLOGY; Part Description: +1.5V, 4Gb (32Meg x 16 x 8 banks) DDR3L SDRAM; PressFit: No; Bonding: No; Manufacturer Part Number: MT41K256M16TW-107:P; Part Number: MT41K256M16TW-107:P; Component Kind: Standard; Component Type: Standard; Device: MT41K256M16TW-107:P; PackageDescription: BGA 0.8mm, Pitch, Square 96 Pin, 9 Columns x 16 Rows, Body 14mm X 8mm X 1.2mm H; Pin Count: 96; Case: BGA96; Mounted: Yes; Socket: No; SMD: Yes; Sense: No; ComponentHeight: 1.2mm; HelpURL: \\cern.ch\dfs\Applications\Altium\Datasheets\MT41K256M16TW-107-P.pdf; Author: CERN DEM MR; CreateDate: 14.12.2015; LatestRevisionDate: 14.12.2015
IC28 = TPS51200DRCT: Sink/Source DDR Termination Regulator; Manufacturer: TEXAS INSTRUMENTS; Part Description: 3.3V Sink/Source DDR Termination Regulator; PressFit: No; Bonding: No; Manufacturer Part Number: TPS51200DRCT; PackageDescription: SON, 0.50mm Pitch, 10-pin, 3.00mm W  X 3.00mm L X 1.00mm Height, (w/thermal tab 1.75 X 2.50 mm); Part Number: TPS51200DRCT; Component Kind: Standard; Component Type: Standard; Device: TPS51200DRCT; Pin Count: 11; Case: SON10; Mounted: Yes; Socket: No; SMD: Yes; Sense: No; ComponentHeight: 1mm; HelpURL: \\cern.ch\dfs\Applications\Altium\Datasheets\TPS51200DRCT.pdf; Author: CERN DEM JLC; CreateDate: 03.02.2010; LatestRevisionDate: 06.11.2013
R106 R340 = R0402_10K_1%_0.0625W_100PPM: Resistor - 1%; Manufacturer: GENERIC; Part Description: General Purpose Thick Film Chip Resistor; Manufacturer1 Part Number: 232270671003L; TC: ±100ppm/°C; PressFit: No; Manufacturer Part Number: R0402_10K_1%_0.0625W_100PPM; Part Number: R0402_10K_1%_0.0625W_100PPM; Tolerance: ±1%; Value: 10k; Component Kind: Standard; Component Type: Standard; Pin Count: 2; Status: Not Recommended; Power: 0.0625W; Case: 0402; Mounted: Yes; Sense: No; Socket: No; SMD: Yes; Manufacturer1 Example: YAGEO PHYCOMP; Manufacturer1 ComponentHeight: 0.4mm; HelpURL: \\cern.ch\dfs\Applications\Altium\Datasheets\R0402_Phycomp_RC0402.pdf; Author: CERN DEM JLC; CreateDate: 03.12.2007; LatestRevisionDate: 17.10.2012
R107 = R0402_10R_1%_0.0625W_200PPM: Resistor - 1%; Manufacturer: GENERIC; Part Description: General Purpose Thick Film Chip Resistor; Manufacturer1 Part Number: 232270671009L; TC: ±200ppm/°C; PressFit: No; Manufacturer Part Number: R0402_10R_1%_0.0625W_200PPM; Part Number: R0402_10R_1%_0.0625W_200PPM; Tolerance: ±1%; Value: 10; Component Kind: Standard; Component Type: Standard; Pin Count: 2; Status: Not Recommended; Power: 0.0625W; Case: 0402; Mounted: Yes; Sense: No; Socket: No; SMD: Yes; Manufacturer1 Example: YAGEO PHYCOMP; Manufacturer1 ComponentHeight: 0.4mm; HelpURL: \\cern.ch\dfs\Applications\Altium\Datasheets\R0402_Phycomp_RC0402.pdf; Author: CERN DEM JLC; CreateDate: 24.06.2009; LatestRevisionDate: 17.10.2012
R108 R109 R136 R137 = R0402_240R_1%_0.0625W_100PPM: Resistor - 1%; Manufacturer: GENERIC; Part Description: General Purpose Thick Film Chip Resistor; Manufacturer1 Part Number: 232270672401L; TC: ±100ppm/°C; PressFit: No; Manufacturer Part Number: R0402_240R_1%_0.0625W_100PPM; Part Number: R0402_240R_1%_0.0625W_100PPM; Tolerance: ±1%; Value: 240; Component Kind: Standard; Component Type: Standard; Pin Count: 2; Status: Not Recommended; Power: 0.0625W; Case: 0402; Mounted: Yes; Sense: No; Socket: No; SMD: Yes; Manufacturer1 Example: YAGEO PHYCOMP; Manufacturer1 ComponentHeight: 0.4mm; HelpURL: \\cern.ch\dfs\Applications\Altium\Datasheets\R0402_Phycomp_RC0402.pdf; Author: CERN DEM JLC; CreateDate: 03.12.2007; LatestRevisionDate: 17.10.2012
R110-R134 R138 = R0402_43R_1%_0.0625W_100PPM: Resistor - 1%; Manufacturer: GENERIC; Part Description: General Purpose Thick Film Chip Resistor; Manufacturer1 Part Number: 232270674309L; TC: ±100ppm/°C; PressFit: No; Manufacturer Part Number: R0402_43R_1%_0.0625W_100PPM; Part Number: R0402_43R_1%_0.0625W_100PPM; Tolerance: ±1%; Value: 43; Component Kind: Standard; Component Type: Standard; Pin Count: 2; Status: Not Recommended; Power: 0.0625W; Case: 0402; Mounted: Yes; Sense: No; Socket: No; SMD: Yes; Manufacturer1 Example: YAGEO PHYCOMP; Manufacturer1 ComponentHeight: 0.4mm; HelpURL: \\cern.ch\dfs\Applications\Altium\Datasheets\R0402_Phycomp_RC0402.pdf; Author: CERN DEM JLC; CreateDate: 03.12.2007; LatestRevisionDate: 17.10.2012
R135 = R0402_4K7_1%_0.0625W_100PPM: Resistor - 1%; Manufacturer: GENERIC; Part Description: General Purpose Thick Film Chip Resistor; Manufacturer1 Part Number: 232270674702L; TC: ±100ppm/°C; PressFit: No; Manufacturer Part Number: R0402_4K7_1%_0.0625W_100PPM; Part Number: R0402_4K7_1%_0.0625W_100PPM; Tolerance: ±1%; Value: 4k7; Component Kind: Standard; Component Type: Standard; Pin Count: 2; Status: Not Recommended; Power: 0.0625W; Case: 0402; Mounted: Yes; Sense: No; Socket: No; SMD: Yes; Manufacturer1 Example: YAGEO PHYCOMP; Manufacturer1 ComponentHeight: 0.4mm; HelpURL: \\cern.ch\dfs\Applications\Altium\Datasheets\R0402_Phycomp_RC0402.pdf; Author: CERN DEM JLC; CreateDate: 03.12.2007; LatestRevisionDate: 17.10.2012